# Altium schematic sheet V2.SchDoc
size A0; SheetNumber: 1; SheetTotal: 2; SPICEModelCacheYQEDCYZF: <root> / <DocumentId>YQEDCYZF</DocumentId> / </root>
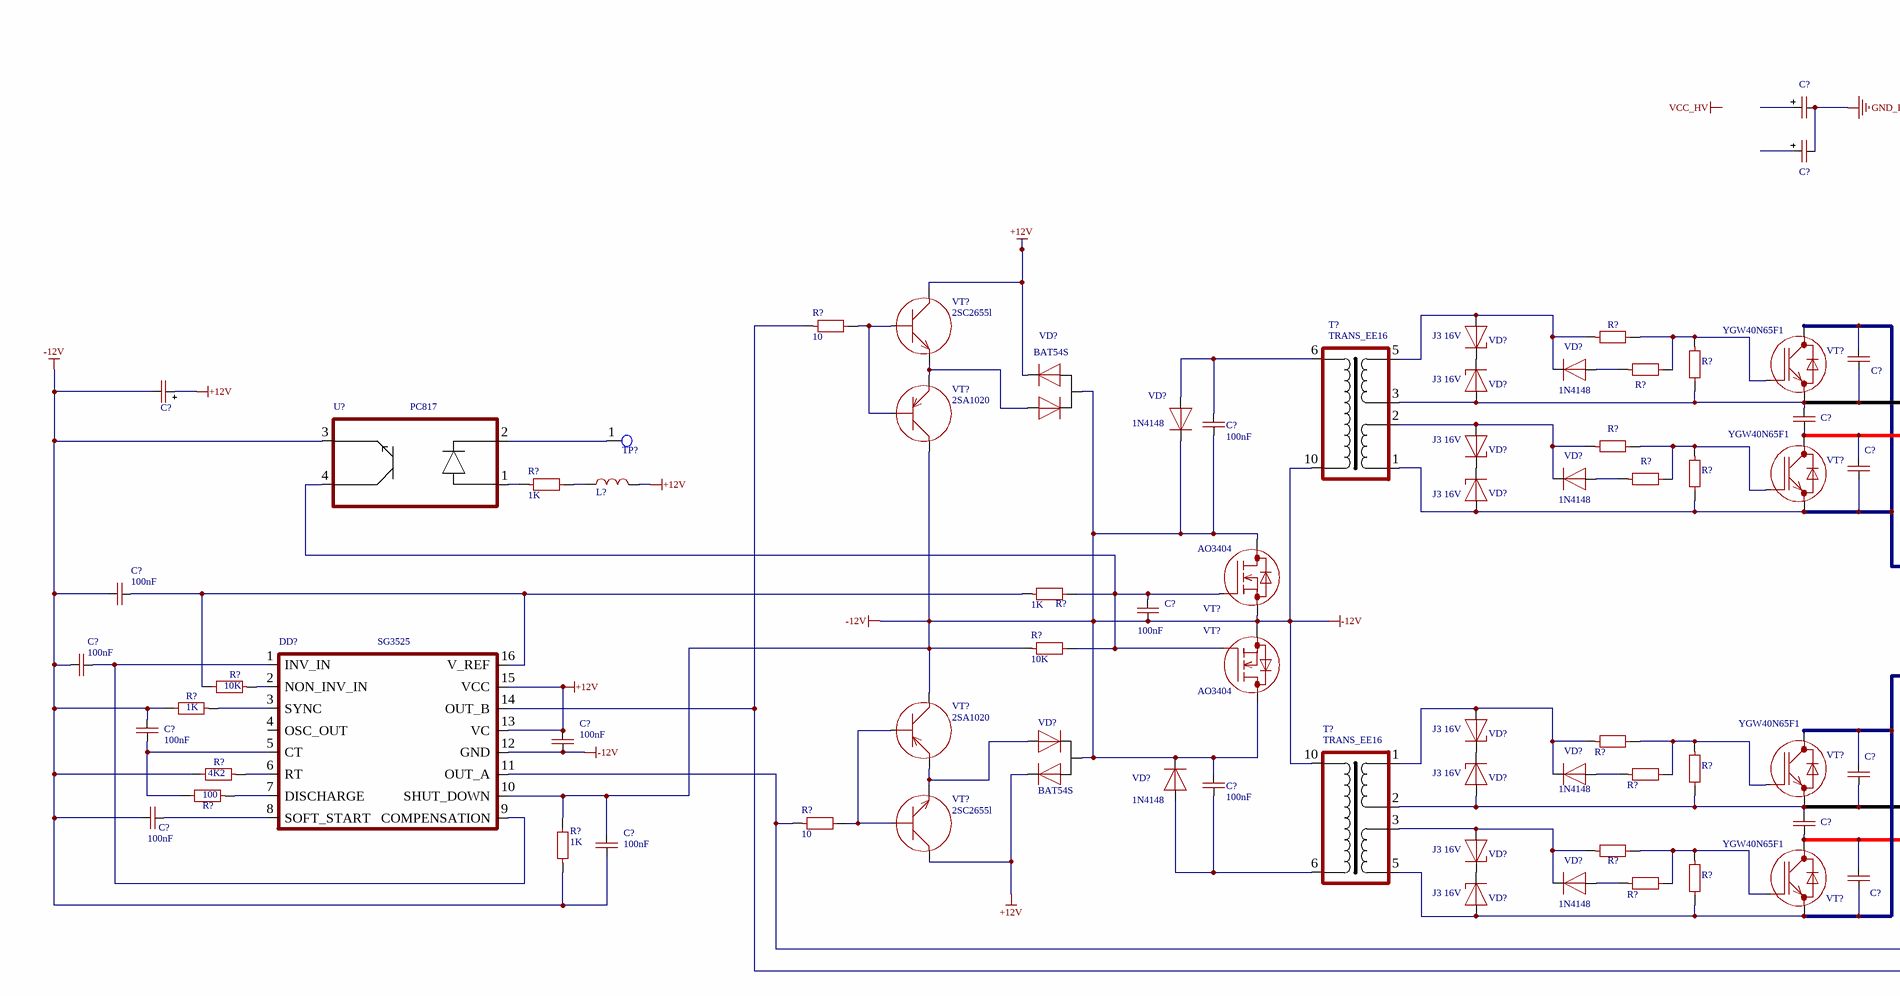
[diagram p0: V2.SchDoc, left]
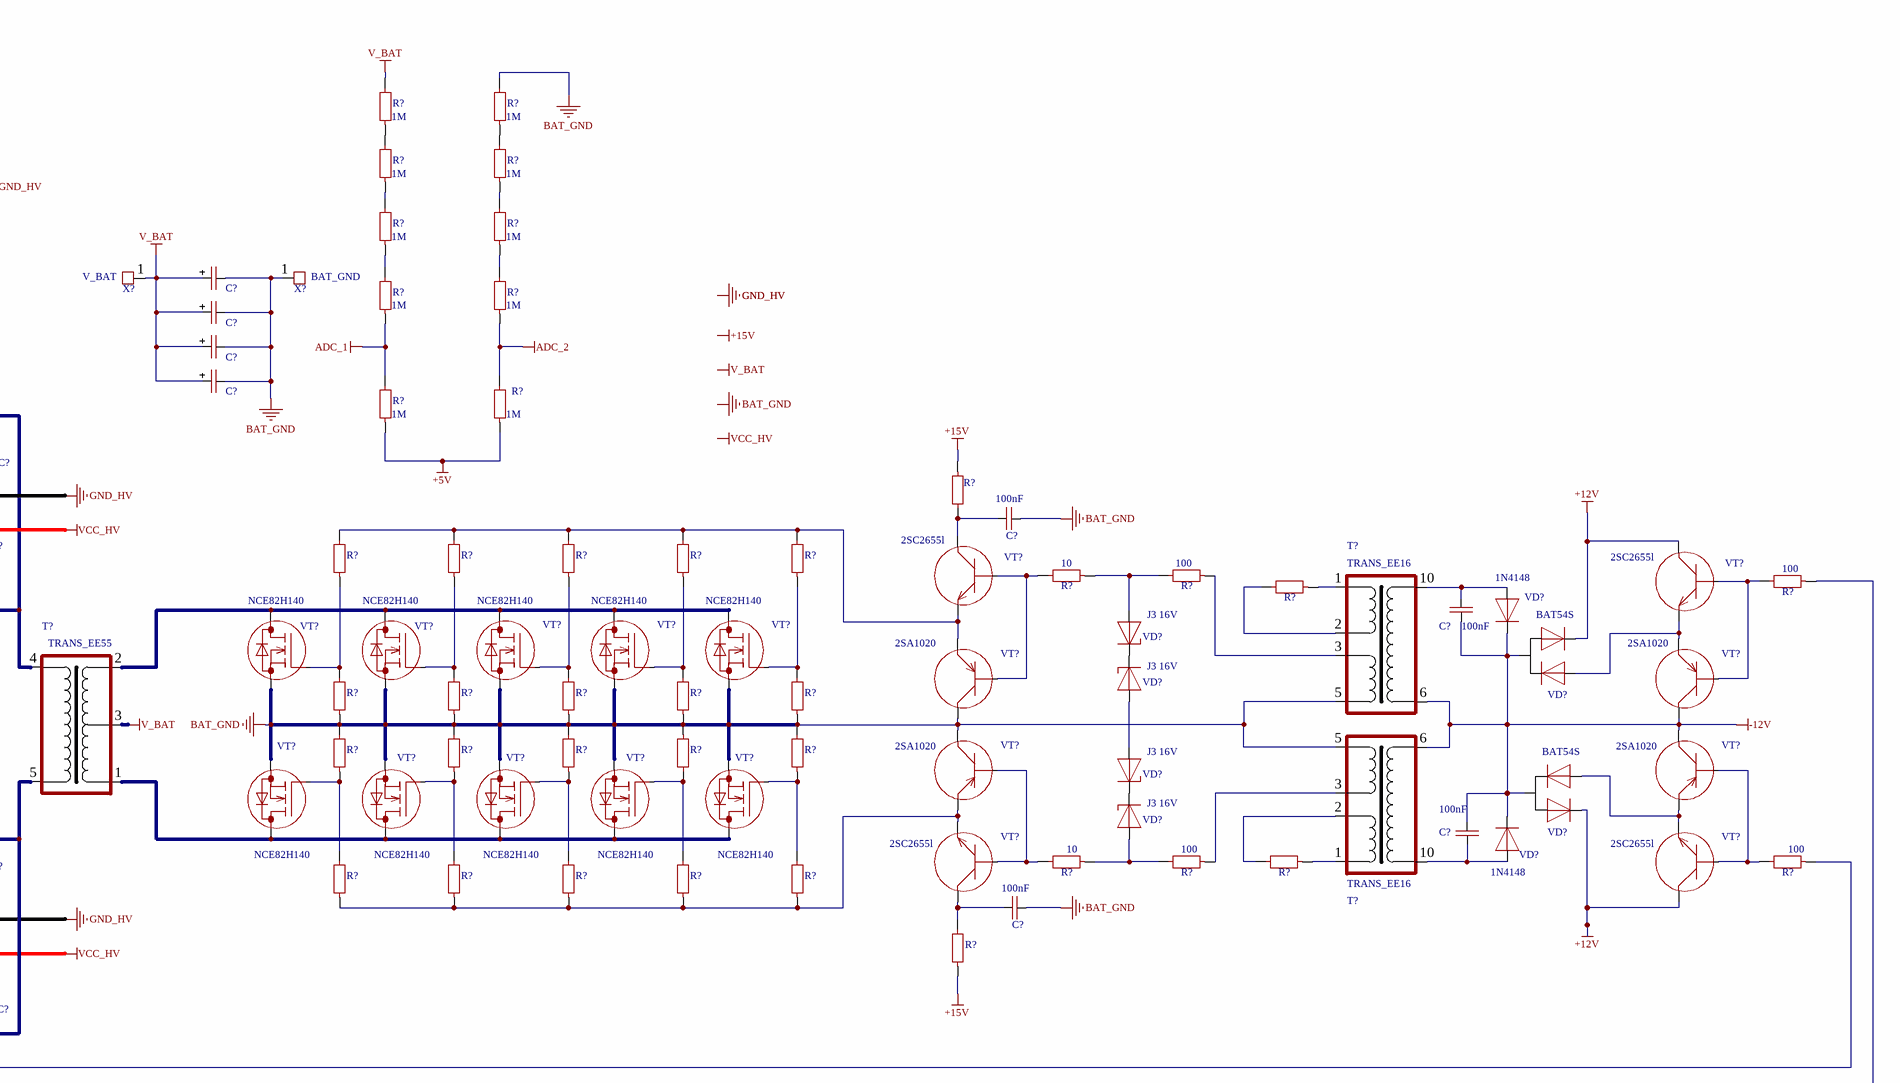
[diagram p1: V2.SchDoc, right]

## Parts
(Parts that share a designator on the sheet are numbered #1, #2 ... from top to bottom, then left to right.)
C?#1  CAP-POLAR  [CAPPOL-30x35]  (value not drawn)
C?#2  CAP-POLAR  [CAPPOL-30x35]  (value not drawn)
C?#3  CAP-POLAR  [CAPPOL-100x35]  (value not drawn)
C?#4  CAP-POLAR  [CAPPOL-100x35]  (value not drawn)
C?#5  CAP-POLAR  [CAPPOL-100x35]  (value not drawn)
C?#6  CAP-POLAR  [CAPPOL-100x35]  (value not drawn)
C?#7  CAP-NON-POLAR  [CAP-FILM-22.5X26.5X10]  (value not drawn)
C?#8  CAP-POLAR  [CAPPOL_SMD_SIZE_E]  (value not drawn)
C?#9  CAP-NON-POLAR  [CAP-FILM-22.5X26.5X10]  (value not drawn)
C?#10  100nF  [CAP-1206]
C?#11  100nF  [CAP-0805]
C?#12  CAP-NON-POLAR  [CAP-FILM-22.5X26.5X10]  (value not drawn)
C?#13  100nF  [CAP-1206]
C?#14  100nF  [CAP-0805]
C?#15  100nF  [CAP-1206]
C?#16  100nF  [CAP-0805]
C?#17  100nF  [CAP-1206]
C?#18  100nF  [CAP-0805]
C?#19  100nF  [CAP-0805]
C?#20  CAP-NON-POLAR  [CAP-FILM-22.5X26.5X10]  (value not drawn)
C?#21  100nF  [CAP-1206]
C?#22  100nF  [CAP-0805]
C?#23  100nF  [CAP-0805]
C?#24  CAP-NON-POLAR  [CAP-FILM-22.5X26.5X10]  (value not drawn)
C?#25  100nF  [CAP-0805]
C?#26  CAP-NON-POLAR  [CAP-FILM-22.5X26.5X10]  (value not drawn)
DD?  SG3525  [SO16-150]
L?  IND-CONST  [IND-7850]  (value not drawn)
R?#1  1M  [RES-0805]
R?#2  1M  [RES-0805]
R?#3  1M  [RES-0805]
R?#4  1M  [RES-0805]
R?#5  1M  [RES-0805]
R?#6  1M  [RES-0805]
R?#7  1M  [RES-0805]
R?#8  1M  [RES-0805]
R?#9  1M  [RES-0805]
R?#10  1M  [RES-0805]
R?#11  10  [RES-0805]
R?#12  RES-CONST  [RES-1206]  (value not drawn)
R?#13  RES-CONST  [RES-1206]  (value not drawn)
R?#14  RES-CONST  [RES-1206]  (value not drawn)
R?#15  RES-CONST  [RES-2512]  (value not drawn)
R?#16  RES-CONST  [RES-1206]  (value not drawn)
R?#17  RES-CONST  [RES-1206]  (value not drawn)
R?#18  RES-CONST  [RES-1206]  (value not drawn)
R?#19  RES-CONST  [RES-1206]  (value not drawn)
R?#20  RES-CONST  [RES-1206]  (value not drawn)
R?#21  RES-CONST  [RES-1206]  (value not drawn)
R?#22  RES-CONST  [RES-1206]  (value not drawn)
R?#23  RES-CONST  [RES-1206]  (value not drawn)
R?#24  10  [RES-1206]
R?#25  100  [RES-1206]
R?#26  1K  [RES-0805]
R?#27  100  [RES-1206]
R?#28  RES-CONST  [RES-2512]  (value not drawn)
R?#29  1K  [RES-1206]
R?#30  RES-CONST  [RES-1206]  (value not drawn)
R?#31  RES-CONST  [RES-1206]  (value not drawn)
R?#32  RES-CONST  [RES-1206]  (value not drawn)
R?#33  RES-CONST  [RES-1206]  (value not drawn)
R?#34  RES-CONST  [RES-1206]  (value not drawn)
R?#35  10K  [RES-1206]
R?#36  RES-CONST  [RES-1206]  (value not drawn)
R?#37  RES-CONST  [RES-1206]  (value not drawn)
R?#38  RES-CONST  [RES-1206]  (value not drawn)
R?#39  RES-CONST  [RES-1206]  (value not drawn)
R?#40  RES-CONST  [RES-1206]  (value not drawn)
R?#41  10K  [RES-0805]
R?#42  1K  [RES-0805]
R?#43  RES-CONST  [RES-1206]  (value not drawn)
R?#44  10  [RES-1206]
R?#45  100  [RES-1206]
R?#46  RES-CONST  [RES-2512]  (value not drawn)
R?#47  100  [RES-1206]
R?#48  RES-CONST  [RES-1206]  (value not drawn)
R?#49  RES-CONST  [RES-1206]  (value not drawn)
R?#50  RES-CONST  [RES-1206]  (value not drawn)
R?#51  RES-CONST  [RES-1206]  (value not drawn)
R?#52  RES-CONST  [RES-1206]  (value not drawn)
R?#53  RES-CONST  [RES-1206]  (value not drawn)
R?#54  4K2  [RES-0805]
R?#55  RES-CONST  [RES-1206]  (value not drawn)
R?#56  100  [RES-0805]
R?#57  10  [RES-1206]
R?#58  RES-CONST  [RES-2512]  (value not drawn)
R?#59  1K  [RES-0805]
R?#60  RES-CONST  [RES-1206]  (value not drawn)
R?#61  RES-CONST  [RES-1206]  (value not drawn)
R?#62  RES-CONST  [RES-1206]  (value not drawn)
T?#1  TRANS_EE16  [TRANS_EE16]
T?#2  TRANS_EE16  [TRANS_EE16]
T?#3  TRANS_EE55  [TRANS_EE55]
T?#4  TRANS_EE16  [TRANS_EE16]
T?#5  TRANS_EE16  [TRANS_EE16]
TP?  Test_Point_PCB  [Test_Point]  (value not drawn)
U?  PC817  [4-SMD]
VD?#1  J3 16V  [SOD-123]
VD?#2  BAT54S  [SOT23-3]
VD?#3  1N4148  [SOD-123]
VD?#4  J3 16V  [SOD-123]
VD?#5  1N4148  [SOD-123]
VD?#6  J3 16V  [SOD-123]
VD?#7  1N4148  [SOD-123]
VD?#8  J3 16V  [SOD-123]
VD?#9  1N4148  [SOD-123]
VD?#10  BAT54S  [SOT23-3]
VD?#11  J3 16V  [SOD-123]
VD?#12  J3 16V  [SOD-123]
VD?#13  J3 16V  [SOD-123]
VD?#14  J3 16V  [SOD-123]
VD?#15  BAT54S  [SOT23-3]
VD?#16  J3 16V  [SOD-123]
VD?#17  1N4148  [SOD-123]
VD?#18  J3 16V  [SOD-123]
VD?#19  1N4148  [SOD-123]
VD?#20  1N4148  [SOD-123]
VD?#21  BAT54S  [SOT23-3]
VD?#22  J3 16V  [SOD-123]
VD?#23  1N4148  [SOD-123]
VD?#24  J3 16V  [SOD-123]
VT?#1  2SC2655l  [SOT23-3]
VT?#2  YGW40N65F1  [TO-92]
VT?#3  2SA1020  [TO-92]
VT?#4  YGW40N65F1  [TO-92]
VT?#5  2SC2655l  [SOT23-3]
VT?#6  2SC2655l  [SOT23-3]
VT?#7  NCE82H140  [TO-220-3]
VT?#8  NCE82H140  [TO-220-3]
VT?#9  NCE82H140  [TO-220-3]
VT?#10  NCE82H140  [TO-220-3]
VT?#11  NCE82H140  [TO-220-3]
VT?#12  AO3404  [SOT23-3]
VT?#13  2SA1020  [TO-92]
VT?#14  2SA1020  [TO-92]
VT?#15  AO3404  [SOT23-3]
VT?#16  2SA1020  [TO-92]
VT?#17  2SA1020  [TO-92]
VT?#18  NCE82H140  [TO-220-3]
VT?#19  NCE82H140  [TO-220-3]
VT?#20  NCE82H140  [TO-220-3]
VT?#21  NCE82H140  [TO-220-3]
VT?#22  NCE82H140  [TO-220-3]
VT?#23  2SA1020  [TO-92]
VT?#24  2SC2655l  [SOT23-3]
VT?#25  2SC2655l  [SOT23-3]
VT?#26  YGW40N65F1  [TO-92]
VT?#27  2SC2655l  [SOT23-3]
VT?#28  YGW40N65F1  [TO-92]
X?#1  BAT_GND  [Terminal_18x18_M8]
X?#2  V_BAT  [Terminal_18x18_M8]

## Nets
+5V: R?#9.1 R?#10.1
+12V: C?#8.1(+) C?#19.2 DD?.13(VC) DD?.15(VCC) L?.2 VD?#2.2(C) VD?#10.2(C) VD?#15.2(C) VD?#21.2(C) VT?#1.2(C) VT?#6.2(C) VT?#25.2(C) VT?#27.2(C)
+15V: R?#15.1 R?#58.1
-12V: C?#8.2(-) C?#10.1 C?#13.2 C?#14.2 C?#15.1 C?#16.2 C?#17.1 C?#18.1 C?#19.1 C?#21.2 C?#23.2 C?#25.1 C?#25.2 DD?.10(SHUT_DOWN) DD?.12(GND) R?#35.1 R?#42.2 R?#54.2 R?#59.1 R?#59.2 T?#1.10 T?#2.6 T?#4.6 T?#5.10 U?.3(EMITTER) VD?#2.3(x) VD?#5.1(C) VD?#9.1(C) VD?#10.3(x) VD?#15.3(x) VD?#17.1(C) VD?#20.1(C) VD?#21.3(x) VT?#3.2(C) VT?#12.2(S) VT?#12.3(D) VT?#14.2(C) VT?#15.2(S) VT?#15.3(D) VT?#17.2(C) VT?#23.2(C)
ADC_1: R?#7.1 R?#9.2
ADC_2: R?#8.1 R?#10.2
BAT_GND: C?#3.2(-) C?#4.2(-) C?#5.2(-) C?#6.2(-) C?#11.1 C?#22.1 R?#2.2 R?#30.1 R?#31.1 R?#32.1 R?#33.1 R?#34.1 R?#36.2 R?#37.2 R?#38.2 R?#39.1 R?#40.2 T?#2.5 T?#4.5 VT?#7.3(S) VT?#8.3(S) VT?#9.3(S) VT?#10.3(S) VT?#11.3(S) VT?#13.2(C) VT?#16.2(C) VT?#18.3(S) VT?#19.3(S) VT?#20.3(S) VT?#21.3(S) VT?#22.3(S) X?#1.1
GND_HV: C?#1.2(-) C?#2.2(-) C?#7.1 C?#9.2 C?#20.1 C?#24.2 R?#13.2 R?#48.2 T?#1.3 T?#5.2 VD?#4.2(A) VD?#18.2(A) VT?#2.3(E) VT?#26.3(E)
V_BAT: C?#3.1(+) C?#4.1(+) C?#5.1(+) C?#6.1(+) R?#1.2 T?#3.3 X?#2.1
VCC_HV: C?#9.1 C?#12.2 C?#24.1 C?#26.2 VT?#4.2(C) VT?#28.2(C)
NetC?#7_2: C?#7.2 C?#12.1 R?#22.2 T?#1.1 T?#3.4 VD?#8.2(A) VT?#2.2(C) VT?#4.3(E)
NetC?#10_2: C?#10.2 T?#1.6 VD?#5.2(A)
NetC?#11_2: C?#11.2 R?#15.2 VT?#5.2(C)
NetC?#13_1: C?#13.1 T?#2.10 VD?#9.2(A)
NetC?#14_1: C?#14.1 DD?.16(V_REF) R?#29.1 R?#41.2
NetC?#15_2: C?#15.2 R?#29.2 R?#35.2 U?.4(COLLECTOR) VT?#12.1(G) VT?#15.1(G)
NetC?#16_1: C?#16.1 DD?.1(INV_IN) DD?.9(COMPENSATION)
NetC?#17_2: C?#17.2 T?#4.10 VD?#17.2(A)
NetC?#18_2: C?#18.2 DD?.5(CT) R?#56.2
NetC?#20_2: C?#20.2 C?#26.1 R?#61.2 T?#3.5 T?#5.5 VD?#24.2(A) VT?#26.2(C) VT?#28.3(E)
NetC?#21_1: C?#21.1 T?#5.6 VD?#20.2(A)
NetC?#22_2: C?#22.2 R?#58.2 VT?#24.2(C)
NetC?#23_1: C?#23.1 DD?.8(SOFT_START)
NetDD?_2: DD?.2(NON_INV_IN) R?#41.1
NetDD?_3: DD?.3(SYNC) R?#42.1
NetDD?_6: DD?.6(RT) R?#54.1
NetDD?_7: DD?.7(DISCHARGE) R?#56.1
NetDD?_11: DD?.11(OUT_A) R?#47.1 R?#57.1
NetDD?_14: DD?.14(OUT_B) R?#11.1 R?#27.1
NetL?_1: L?.1 R?#26.2
NetR?#1_1: R?#1.1 R?#3.2
NetR?#2_1: R?#2.1 R?#4.2
NetR?#3_1: R?#3.1 R?#5.2
NetR?#4_1: R?#4.1 R?#6.2
NetR?#5_1: R?#5.1 R?#7.2
NetR?#6_1: R?#6.1 R?#8.2
NetR?#11_2: R?#11.2 VT?#1.3(B) VT?#3.3(B)
NetR?#12_1: R?#12.1 T?#1.5 VD?#1.2(A) VD?#3.1(C)
NetR?#12_2: R?#12.2 R?#13.1 R?#14.2 VT?#2.1(G)
NetR?#14_1: R?#14.1 VD?#3.2(A)
NetR?#16_1: R?#16.1 T?#1.2 VD?#6.2(A) VD?#7.1(C)
NetR?#16_2: R?#16.2 R?#22.1 R?#23.2 VT?#4.1(G)
NetR?#17_1: R?#17.1 R?#30.2 VT?#7.1(G)
NetR?#17_2: R?#17.2 R?#18.2 R?#19.2 R?#20.2 R?#21.2 VT?#5.1(E) VT?#13.1(E)
NetR?#18_1: R?#18.1 R?#31.2 VT?#8.1(G)
NetR?#19_1: R?#19.1 R?#32.2 VT?#9.1(G)
NetR?#20_1: R?#20.1 R?#33.2 VT?#10.1(G)
NetR?#21_1: R?#21.1 R?#34.2 VT?#11.1(G)
NetR?#23_1: R?#23.1 VD?#7.2(A)
NetR?#24_1: R?#24.1 R?#25.2 VD?#11.2(A)
NetR?#24_2: R?#24.2 VT?#5.3(B) VT?#13.3(B)
NetR?#25_1: R?#25.1 T?#2.3
NetR?#26_1: R?#26.1 U?.1(ANODE)
NetR?#27_2: R?#27.2 VT?#6.3(B) VT?#14.3(B)
NetR?#28_1: R?#28.1 T?#2.1
NetR?#28_2: R?#28.2 T?#2.2
NetR?#36_1: R?#36.1 R?#49.2 VT?#18.1(G)
NetR?#37_1: R?#37.1 R?#50.2 VT?#19.1(G)
NetR?#38_1: R?#38.1 R?#51.2 VT?#20.1(G)
NetR?#39_2: R?#39.2 R?#52.2 VT?#21.1(G)
NetR?#40_1: R?#40.1 R?#53.2 VT?#22.1(G)
NetR?#43_1: R?#43.1 T?#5.1 VD?#16.2(A) VD?#19.1(C)
NetR?#43_2: R?#43.2 R?#48.1 R?#55.2 VT?#26.1(G)
NetR?#44_1: R?#44.1 R?#45.2 VD?#14.2(A)
NetR?#44_2: R?#44.2 VT?#16.3(B) VT?#24.3(B)
NetR?#45_1: R?#45.1 T?#4.3
NetR?#46_1: R?#46.1 T?#4.1
NetR?#46_2: R?#46.2 T?#4.2
NetR?#47_2: R?#47.2 VT?#17.3(B) VT?#25.3(B)
NetR?#49_1: R?#49.1 R?#50.1 R?#51.1 R?#52.1 R?#53.1 VT?#16.1(E) VT?#24.1(E)
NetR?#55_1: R?#55.1 VD?#19.2(A)
NetR?#57_2: R?#57.2 VT?#23.3(B) VT?#27.3(B)
NetR?#60_1: R?#60.1 T?#5.3 VD?#22.2(A) VD?#23.1(C)
NetR?#60_2: R?#60.2 R?#61.1 R?#62.2 VT?#28.1(G)
NetR?#62_1: R?#62.1 VD?#23.2(A)
NetT?#3_1: T?#3.1 VT?#18.2(D) VT?#19.2(D) VT?#20.2(D) VT?#21.2(D) VT?#22.2(D)
NetT?#3_2: T?#3.2 VT?#7.2(D) VT?#8.2(D) VT?#9.2(D) VT?#10.2(D) VT?#11.2(D)
NetTP?_1: TP?.1(G9) U?.2(CATHODE)
NetVD?#1_1: VD?#1.1(C) VD?#4.1(C)
NetVD?#2_1: VD?#2.1(A) VT?#1.1(E) VT?#3.1(E)
NetVD?#6_1: VD?#6.1(C) VD?#8.1(C)
NetVD?#10_1: VD?#10.1(A) VT?#6.1(E) VT?#14.1(E)
NetVD?#11_1: VD?#11.1(C) VD?#12.1(C)
NetVD?#12_2: VD?#12.2(A) VD?#13.2(A)
NetVD?#13_1: VD?#13.1(C) VD?#14.1(C)
NetVD?#15_1: VD?#15.1(A) VT?#17.1(E) VT?#25.1(E)
NetVD?#16_1: VD?#16.1(C) VD?#18.1(C)
NetVD?#21_1: VD?#21.1(A) VT?#23.1(E) VT?#27.1(E)
NetVD?#22_1: VD?#22.1(C) VD?#24.1(C)

Not connected (* = marked no-connect by the designer): C?#1 1(+); C?#2 1(+); DD? 4(OSC_OUT)

## Notes on the sheet
- Labels drawn without touching a wire or pin: +15V, BAT_GND, V_BAT, VCC_HV

## Library data of the parts
C?#10 C?#11 C?#13-C?#19 C?#21-C?#23 C?#25 = CAP-NON-POLAR
R?#1-R?#11 R?#24-R?#27 R?#29 R?#35 R?#41 R?#42 R?#44 R?#45 R?#47 R?#54 R?#56 R?#57 R?#59 = RES-CONST
TP? = TP_PCB?: Test_Point
VD?#1 VD?#4 VD?#6 VD?#8 VD?#11-VD?#14 VD?#16 VD?#18 VD?#22 VD?#24 = ZENER
VD?#2 VD?#10 VD?#15 VD?#21 = DIODE-4
VD?#3 VD?#5 VD?#7 VD?#9 VD?#17 VD?#19 VD?#20 VD?#23 = DIODE
VT?#1 VT?#5 VT?#6 VT?#24 VT?#25 VT?#27 = BIPOLAR-NPN-ECB
VT?#2 VT?#4 VT?#26 VT?#28 = IGBT-N-GCE
VT?#3 VT?#13 VT?#14 VT?#16 VT?#17 VT?#23 = BIPOLAR-PNP-ECB
VT?#7-VT?#12 VT?#15 VT?#18-VT?#22 = MOSFET-N-GDS
X?#1 X?#2 = Terminal_18x18_M8